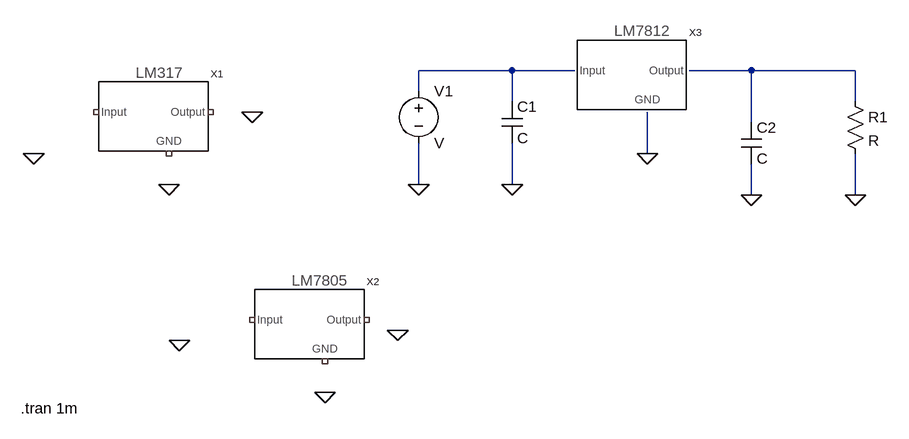
[diagram p0: schematic Draft2.asc]
Draft2.asc, the LTspice schematic file:
Version 4
SHEET 1 888 696
WIRE 304 160 160 160
WIRE 400 160 304 160
WIRE 672 160 576 160
WIRE 832 160 672 160
WIRE 160 192 160 160
WIRE 304 208 304 160
WIRE 832 208 832 160
WIRE 672 240 672 160
WIRE 512 288 512 224
WIRE 160 336 160 272
WIRE 304 336 304 272
WIRE 672 352 672 304
WIRE 832 352 832 288
FLAG 16 656 0
FLAG 128 560 0
FLAG -208 576 0
FLAG -96 224 0
FLAG -224 336 0
FLAG -432 288 0
FLAG 512 288 0
FLAG 304 336 0
FLAG 672 352 0
FLAG 832 352 0
FLAG 160 336 0
SYMBOL LM317 -256 192 R0
SYMATTR InstName X1
SYMBOL LM7805 -16 512 R0
SYMATTR InstName X2
SYMBOL LM7812 480 128 R0
SYMATTR InstName X3
SYMBOL cap 288 208 R0
SYMATTR InstName C1
SYMBOL cap 656 240 R0
SYMATTR InstName C2
SYMBOL res 816 192 R0
SYMATTR InstName R1
SYMBOL voltage 160 176 R0
SYMATTR InstName V1
TEXT -452 680 Left 2 !.tran 1m

The netlist it stands for:
* Draft2.asc
XX1 NC_01 NC_02 NC_03 LM317  ; pins Input GND Output
XX2 NC_04 NC_05 NC_06 LM7805  ; pins Input GND Output
XX3 N001 0 N002 LM7812  ; pins Input GND Output
C1 N001 0 C
C2 N002 0 C
R1 N002 0 R
V1 N001 0 V
.tran 1m
.backanno
.end